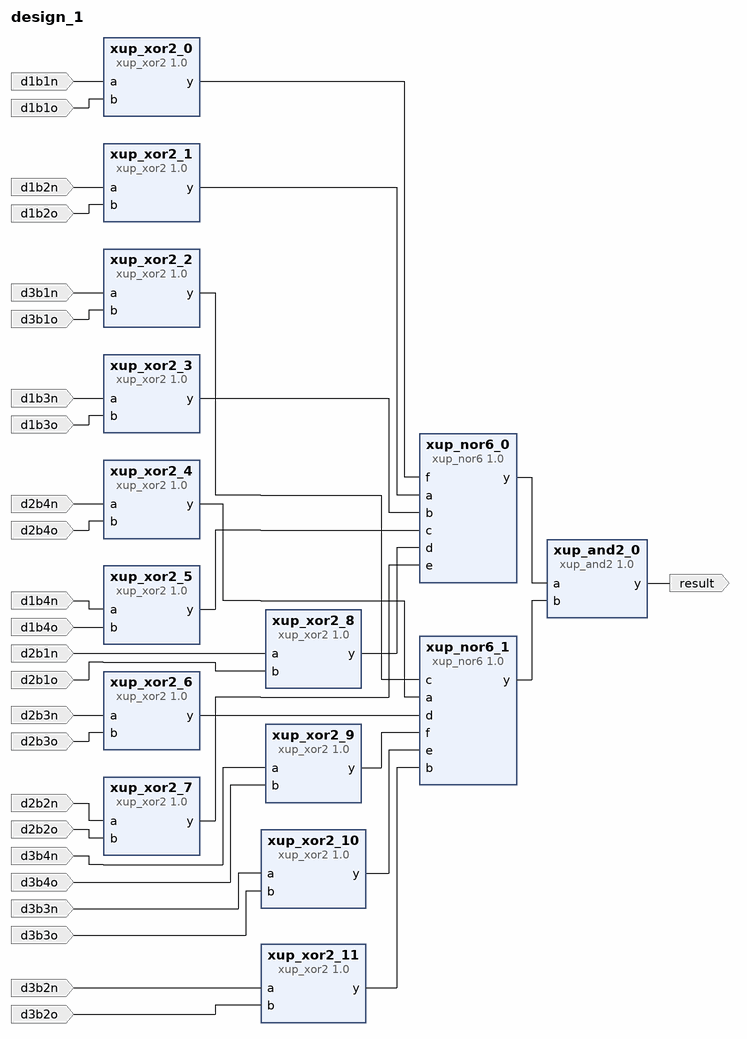
[diagram p0: block diagram of the top level]
# Vivado block design design_1, xc7a35tcpg236-1, Vivado 2018.2
create_bd_design design_1

create_bd_port -dir I d1b1n
create_bd_port -dir I d1b2n
create_bd_port -dir I d1b3n
create_bd_port -dir I d1b4n
create_bd_port -dir I d2b1n
create_bd_port -dir I d2b2n
create_bd_port -dir I d2b3n
create_bd_port -dir I d2b4n
create_bd_port -dir I d3b1n
create_bd_port -dir I d3b2n
create_bd_port -dir I d3b3n
create_bd_port -dir I d3b4n
create_bd_port -dir I d1b1o
create_bd_port -dir I d1b2o
create_bd_port -dir I d1b3o
create_bd_port -dir I d1b4o
create_bd_port -dir I d2b1o
create_bd_port -dir I d2b2o
create_bd_port -dir I d2b3o
create_bd_port -dir I d2b4o
create_bd_port -dir I d3b1o
create_bd_port -dir I d3b2o
create_bd_port -dir I d3b3o
create_bd_port -dir I d3b4o
create_bd_port -dir O result

create_bd_cell -type ip -vlnv xilinx.com:XUP:xup_xor2:1.0 xup_xor2_0
create_bd_cell -type ip -vlnv xilinx.com:XUP:xup_xor2:1.0 xup_xor2_1
create_bd_cell -type ip -vlnv xilinx.com:XUP:xup_xor2:1.0 xup_xor2_2
create_bd_cell -type ip -vlnv xilinx.com:XUP:xup_xor2:1.0 xup_xor2_3
create_bd_cell -type ip -vlnv xilinx.com:XUP:xup_xor2:1.0 xup_xor2_4
create_bd_cell -type ip -vlnv xilinx.com:XUP:xup_xor2:1.0 xup_xor2_5
create_bd_cell -type ip -vlnv xilinx.com:XUP:xup_xor2:1.0 xup_xor2_6
create_bd_cell -type ip -vlnv xilinx.com:XUP:xup_xor2:1.0 xup_xor2_7
create_bd_cell -type ip -vlnv xilinx.com:XUP:xup_xor2:1.0 xup_xor2_8
create_bd_cell -type ip -vlnv xilinx.com:XUP:xup_xor2:1.0 xup_xor2_9
create_bd_cell -type ip -vlnv xilinx.com:XUP:xup_xor2:1.0 xup_xor2_10
create_bd_cell -type ip -vlnv xilinx.com:XUP:xup_xor2:1.0 xup_xor2_11
create_bd_cell -type ip -vlnv xilinx.com:XUP:xup_nor6:1.0 xup_nor6_0
create_bd_cell -type ip -vlnv xilinx.com:XUP:xup_nor6:1.0 xup_nor6_1
create_bd_cell -type ip -vlnv xilinx.com:XUP:xup_and2:1.0 xup_and2_0

# ---- connections ----

connect_bd_net [get_bd_ports d1b1n] [get_bd_pins xup_xor2_0/a]
connect_bd_net [get_bd_ports d1b2n] [get_bd_pins xup_xor2_1/a]
connect_bd_net [get_bd_ports d1b3n] [get_bd_pins xup_xor2_3/a]
connect_bd_net [get_bd_ports d1b4n] [get_bd_pins xup_xor2_5/a]
connect_bd_net [get_bd_ports d2b1n] [get_bd_pins xup_xor2_8/a]
connect_bd_net [get_bd_ports d2b2n] [get_bd_pins xup_xor2_7/a]
connect_bd_net [get_bd_ports d2b3n] [get_bd_pins xup_xor2_6/a]
connect_bd_net [get_bd_ports d2b4n] [get_bd_pins xup_xor2_4/a]
connect_bd_net [get_bd_ports d3b1n] [get_bd_pins xup_xor2_2/a]
connect_bd_net [get_bd_ports d3b2n] [get_bd_pins xup_xor2_11/a]
connect_bd_net [get_bd_ports d3b3n] [get_bd_pins xup_xor2_10/a]
connect_bd_net [get_bd_ports d3b4n] [get_bd_pins xup_xor2_9/a]
connect_bd_net [get_bd_ports d1b1o] [get_bd_pins xup_xor2_0/b]
connect_bd_net [get_bd_ports d1b2o] [get_bd_pins xup_xor2_1/b]
connect_bd_net [get_bd_ports d1b3o] [get_bd_pins xup_xor2_3/b]
connect_bd_net [get_bd_ports d1b4o] [get_bd_pins xup_xor2_5/b]
connect_bd_net [get_bd_ports d2b1o] [get_bd_pins xup_xor2_8/b]
connect_bd_net [get_bd_ports d2b2o] [get_bd_pins xup_xor2_7/b]
connect_bd_net [get_bd_ports d2b3o] [get_bd_pins xup_xor2_6/b]
connect_bd_net [get_bd_ports d2b4o] [get_bd_pins xup_xor2_4/b]
connect_bd_net [get_bd_ports d3b1o] [get_bd_pins xup_xor2_2/b]
connect_bd_net [get_bd_ports d3b2o] [get_bd_pins xup_xor2_11/b]
connect_bd_net [get_bd_ports d3b3o] [get_bd_pins xup_xor2_10/b]
connect_bd_net [get_bd_ports d3b4o] [get_bd_pins xup_xor2_9/b]
connect_bd_net [get_bd_pins xup_xor2_1/y] [get_bd_pins xup_nor6_0/a]
connect_bd_net [get_bd_pins xup_xor2_3/y] [get_bd_pins xup_nor6_0/b]
connect_bd_net [get_bd_pins xup_xor2_5/y] [get_bd_pins xup_nor6_0/c]
connect_bd_net [get_bd_pins xup_xor2_8/y] [get_bd_pins xup_nor6_0/d]
connect_bd_net [get_bd_pins xup_xor2_7/y] [get_bd_pins xup_nor6_0/e]
connect_bd_net [get_bd_pins xup_xor2_4/y] [get_bd_pins xup_nor6_1/a]
connect_bd_net [get_bd_pins xup_xor2_2/y] [get_bd_pins xup_nor6_1/c]
connect_bd_net [get_bd_pins xup_xor2_11/y] [get_bd_pins xup_nor6_1/b]
connect_bd_net [get_bd_pins xup_xor2_10/y] [get_bd_pins xup_nor6_1/e]
connect_bd_net [get_bd_pins xup_xor2_0/y] [get_bd_pins xup_nor6_0/f]
connect_bd_net [get_bd_pins xup_xor2_6/y] [get_bd_pins xup_nor6_1/d]
connect_bd_net [get_bd_pins xup_xor2_9/y] [get_bd_pins xup_nor6_1/f]
connect_bd_net [get_bd_pins xup_nor6_0/y] [get_bd_pins xup_and2_0/a]
connect_bd_net [get_bd_pins xup_nor6_1/y] [get_bd_pins xup_and2_0/b]
connect_bd_net [get_bd_pins xup_and2_0/y] [get_bd_ports result]

validate_bd_design
save_bd_design
